# Altium schematic sheet ESC_IMU.SchDoc
size A
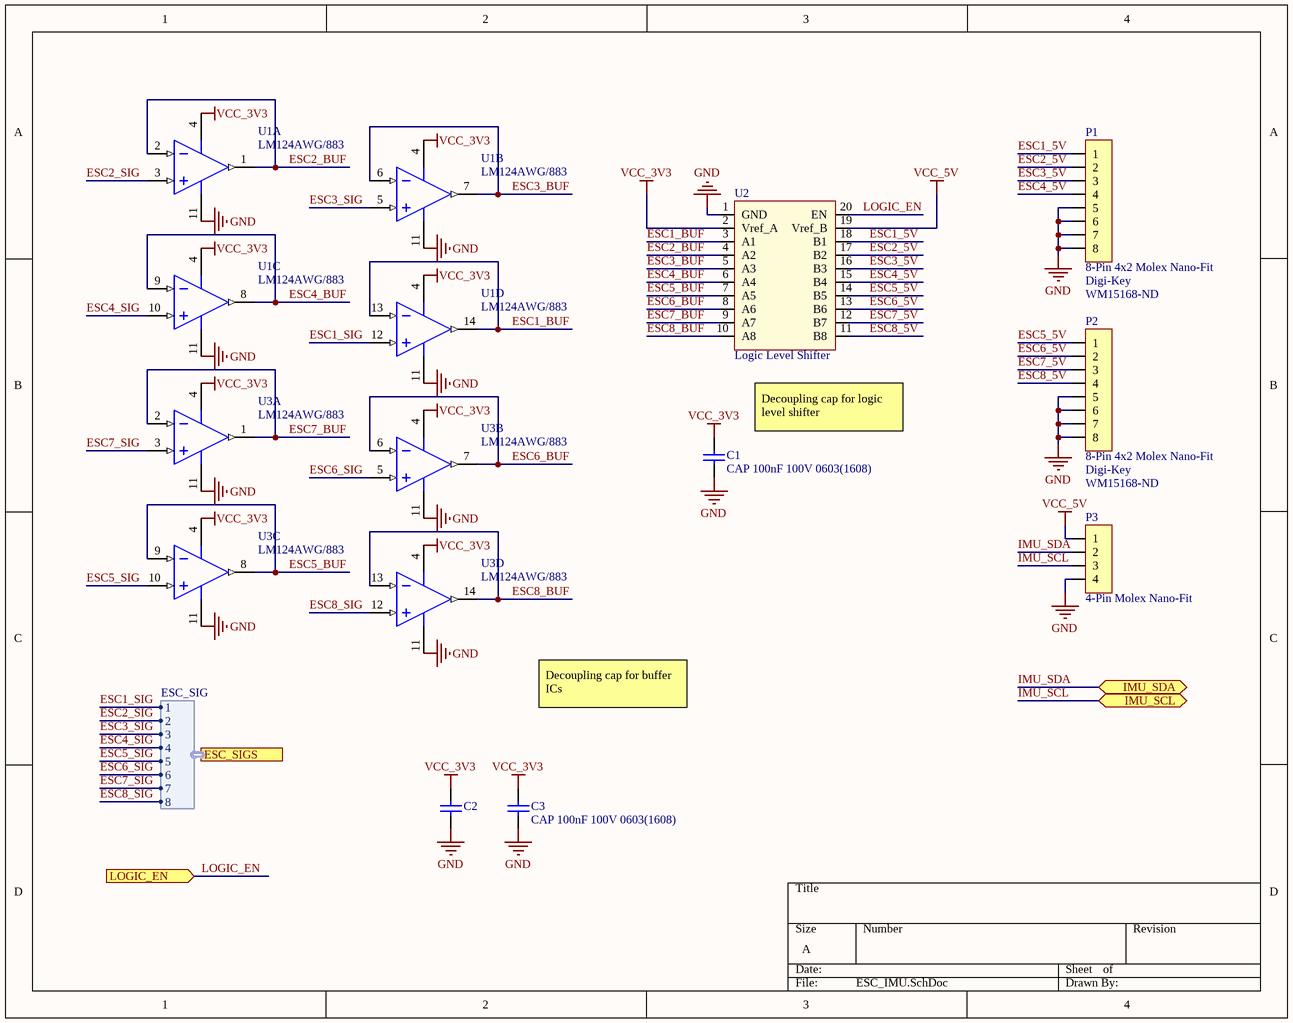
[diagram p0: ESC_IMU.SchDoc]

## Parts
C1  CAP 100nF 100V 0603(1608)  [CAPC0603(1608)100_L]
C2  CAP 100nF 100V 0603(1608)  [CAPC0603(1608)100_L]  (value not drawn)
C3  CAP 100nF 100V 0603(1608)  [CAPC0603(1608)100_L]
P1  8-Pin 4x2 Molex Nano-Fit  Supplier 1: Digi-Key  Supplier Part Number 1: WM15168-ND  [MOLEX NANO-FIT 2x4]
P2  8-Pin 4x2 Molex Nano-Fit  Supplier 1: Digi-Key  Supplier Part Number 1: WM15168-ND  [MOLEX NANO-FIT 2x4]
P3  4-Pin Molex Nano-Fit  [MOLEX NANO-FIT 1X4]
U1  LM124AWG/883  [NAC0014A_L]  (parts A,B,C,D of 4)
U2  Logic Level Shifter  [TSOP65P640X120-20N]
U3  LM124AWG/883  [NAC0014A_L]  (parts A,B,C,D of 4)

## Ports
ESC_SIGS (harness ESC_SIG), IMU_SCL (bidir), IMU_SDA (bidir), LOGIC_EN (in)

## Harnesses
ESC_SIG: 1, 2, 3, 4, 5, 6, 7, 8

## Nets
GND: C1.2 C2.2 C3.2 P1.5 P1.6 P1.7 P1.8 P2.5 P2.6 P2.7 P2.8 P3.4 U1.11(GND) U2.1(GND) U3.11(GND)
VCC_3V3: C1.1 C2.1 C3.1 U1.4(V+) U2.2(Vref_A) U3.4(V+)
VCC_5V: P3.1 U2.19(Vref_B)
ESC1_5V: P1.1 U2.18(B1)
ESC1_BUF: U1.13(IN4-) U1.14(OUT4) U2.3(A1)
ESC1_SIG: U1.12(IN4+) ; port ESC_SIGS.1
ESC2_5V: P1.2 U2.17(B2)
ESC2_BUF: U1.1(OUT1) U1.2(IN1-) U2.4(A2)
ESC2_SIG: U1.3(IN1+) ; port ESC_SIGS.2
ESC3_5V: P1.3 U2.16(B3)
ESC3_BUF: U1.6(IN2-) U1.7(OUT2) U2.5(A3)
ESC3_SIG: U1.5(IN2+) ; port ESC_SIGS.3
ESC4_5V: P1.4 U2.15(B4)
ESC4_BUF: U1.8(OUT3) U1.9(IN3-) U2.6(A4)
ESC4_SIG: U1.10(IN3+) ; port ESC_SIGS.4
ESC5_5V: P2.1 U2.14(B5)
ESC5_BUF: U2.7(A5) U3.8(OUT3) U3.9(IN3-)
ESC5_SIG: U3.10(IN3+) ; port ESC_SIGS.5
ESC6_5V: P2.2 U2.13(B6)
ESC6_BUF: U2.8(A6) U3.6(IN2-) U3.7(OUT2)
ESC6_SIG: U3.5(IN2+) ; port ESC_SIGS.6
ESC7_5V: P2.3 U2.12(B7)
ESC7_BUF: U2.9(A7) U3.1(OUT1) U3.2(IN1-)
ESC7_SIG: U3.3(IN1+) ; port ESC_SIGS.7
ESC8_5V: P2.4 U2.11(B8)
ESC8_BUF: U2.10(A8) U3.13(IN4-) U3.14(OUT4)
ESC8_SIG: U3.12(IN4+) ; port ESC_SIGS.8
IMU_SCL: P3.3 ; port IMU_SCL
IMU_SDA: P3.2 ; port IMU_SDA
LOGIC_EN: U2.20(EN) ; port LOGIC_EN

## Notes on the sheet
- Decoupling cap for logic level shifter
- Decoupling cap for buffer ICs

## Library data of the parts
C1-C3 = CMP-1035-02595-1: CAP 100nF 100V ±10% 0603 (1608 Metric) Thickness 1mm SMD; Tolerance: Â±10%; Case-EIA: 0603; Case-Metric: 1608; Rated Voltage: 100 V; Value: 100nF; Technology: SMT; Max Thickness: 1 mm
P1 P2 = 8-Pin 2-Row Nano-Fit: NanoFit RA Hdr TH DR 8Ckt; Part Number: 105314-1216; Supplier: Digi-Key; Manufacturer: Molex; Supplier Part Number: WM15165-ND
P3 = 4-Pin Nano-Fit: NanoFit RA Hdr TH SR 4Ckt; Part Number: 105313-1204; Supplier: Mouser; Manufacturer: Molex; Supplier Part Number: 538-105313-1204
U1 U3 = CMP-0055-00919-3: Low Power Quad Operational Amplifier, 14-pin CerPACK; Manufacturer: Texas Instruments; High-Reliability: Y; PackageTopMarking: NSZSSXXYYA*LM124AWG/*883 Q*7704302XA; PowerWise: N; CompType: Amplifiers; RoHS: N; Package Reference: NAC0014A; PackageDescription: Cerpack, .390 x .250 x .070in, 14 Lead, .050in Pitch, Gull Wing; ComponentLink1URL: http://www.ti.com/general/docs/lit/getliterature.tsp?genericPartNumber=LM124AQML&fileType=pdf; ComponentLink1Description: Datasheet URL; PinCount: 14; PartId: 1
U2 = TI LSF0108-Q1: ComponentLink1Description: digikey; ComponentLink1URL: https://www.digikey.com/product-detail/en/texas-instruments/LSF0108QPWRQ1/296-44247-1-ND/6098479